# EAGLE design IotaWatt4.8 (EAGLE 8.1.1)
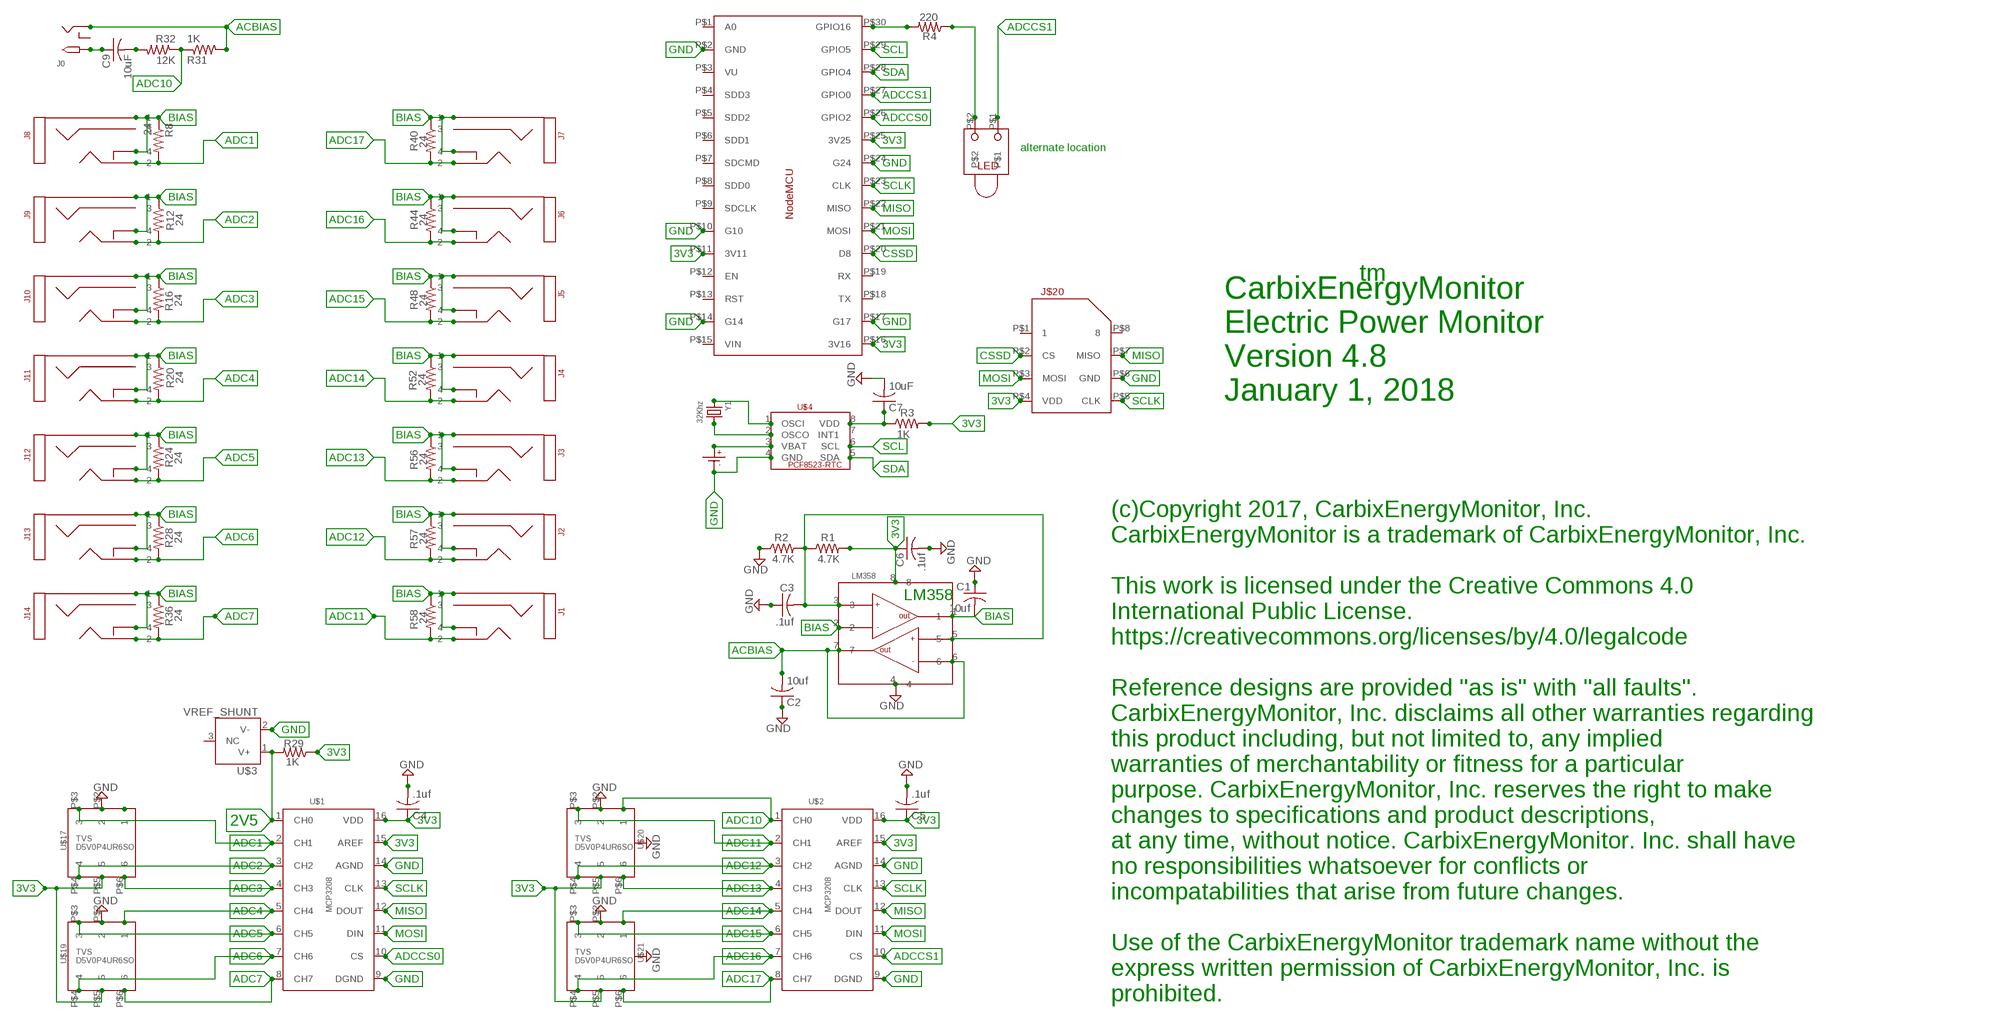
[diagram p0: schematic, sheet 1]

## Parts
C1  10uf  C-USC0805  [C0805]
C2  10uf  C-USC0805  [C0805]
C3  .1uf  C-USC0805  [C0805]
C4  .1uf  C-USC0805  [C0805]
C5  .1uf  C-USC0805  [C0805]
C6  .1uf  C-USC0805  [C0805]
C7  10uF  C-USC0805  [C0805]
C9  10uF  C-USC0805  [C0805]
J0  2.1MMJACKSMT  [DCJACK_2MM_SMT]
J1  STEREO_SMD  [STEREO_SMT]
J2  STEREO_SMD  [STEREO_SMT]
J3  STEREO_SMD  [STEREO_SMT]
J4  STEREO_SMD  [STEREO_SMT]
J5  STEREO_SMD  [STEREO_SMT]
J6  STEREO_SMD  [STEREO_SMT]
J7  STEREO_SMD  [STEREO_SMT]
J8  STEREO_SMD  [STEREO_SMT]
J9  STEREO_SMD  [STEREO_SMT]
J10  STEREO_SMD  [STEREO_SMT]
J11  STEREO_SMD  [STEREO_SMT]
J12  STEREO_SMD  [STEREO_SMT]
J13  STEREO_SMD  [STEREO_SMT]
J14  STEREO_SMD  [STEREO_SMT]
J$20  MICROSD_PUSH/PULL  [MICROSD]
R1  4.7K  R-US_R0805  [R0805]
R2  4.7K  R-US_R0805  [R0805]
R3  1K  R-US_R0805  [R0805]
R4  220  R-US_R0805  [R0805]
R8  24  R-US_R0805  [R0805]
R12  24  R-US_R0805  [R0805]
R16  24  R-US_R0805  [R0805]
R20  24  R-US_R0805  [R0805]
R24  24  R-US_R0805  [R0805]
R28  24  R-US_R0805  [R0805]
R29  1K  R-US_R0805  [R0805]
R31  1K  R-US_R0805  [R0805]
R32  12K  R-US_R0805  [R0805]
R36  24  R-US_R0805  [R0805]
R40  24  R-US_R0805  [R0805]
R44  24  R-US_R0805  [R0805]
R48  24  R-US_R0805  [R0805]
R52  24  R-US_R0805  [R0805]
R56  24  R-US_R0805  [R0805]
R57  24  R-US_R0805  [R0805]
R58  24  R-US_R0805  [R0805]
U$1  MCP3208  [SOIC_16]
U$2  MCP3208  [SOIC_16]
U$3  VREF_SHUNT  [SOT23_3]
U$4  PCF8523_RTC  [SOIC_8]
U$16  NODEMCU  [NODEMCU]
U$17  TVS_4CHAN_ARRAYSC-74  [SC-74]
U$18  CR1220SMD  [CR1220SMD]
U$19  TVS_4CHAN_ARRAYSC-74  [SC-74]
U$20  TVS_4CHAN_ARRAYSC-74  [SC-74]
U$21  TVS_4CHAN_ARRAYSC-74  [SC-74]
U$22  LM358_DUAL_OP-AMP  [SOIC_8]
U$23  LED_RT_TRH  [LED_TH_RT]
Y1  32Khz  CRYSTAL8X3.8SMT  [CRYSTAL_8X3.8]

## Nets
2V5: R29.2 U$1.1(CH0) U$3.1(V+)
3V3: C4.1 C5.1 C6.1 J$20.P$4(VDD) R1.2 R3.2 R29.1 U$1.15(AREF) U$1.16(VDD) U$2.15(AREF) U$2.16(VDD) U$16.P$11(3V11) U$16.P$16(3V16) U$16.P$25(3V25) U$17.P$5 U$19.P$5 U$20.P$5 U$21.P$5 U$22.8
ACBIAS: C2.2 J0.GND(RING) R31.2 U$22.6 U$22.7
ADC1: J8.P$2 R8.2 U$1.2(CH1) U$17.P$3
ADC2: J9.P$2 R12.2 U$1.3(CH2) U$17.P$4
ADC3: J10.P$2 R16.2 U$1.4(CH3) U$17.P$6
ADC4: J11.P$2 R20.2 U$1.5(CH4) U$19.P$1
ADC5: J12.P$2 R24.2 U$1.6(CH5) U$19.P$3
ADC6: J13.P$2 R28.2 U$1.7(CH6) U$19.P$4
ADC7: J14.P$2 R36.2 U$1.8(CH7) U$19.P$6
ADC10: R31.1 R32.1 U$2.1(CH0) U$20.P$1
ADC11: J1.P$2 R58.2 U$2.2(CH1) U$20.P$3
ADC12: J2.P$2 R57.2 U$2.3(CH2) U$20.P$4
ADC13: J3.P$2 R56.2 U$2.4(CH3) U$20.P$6
ADC14: J4.P$2 R52.2 U$2.5(CH4) U$21.P$1
ADC15: J5.P$2 R48.2 U$2.6(CH5) U$21.P$3
ADC16: J6.P$2 R44.2 U$2.7(CH6) U$21.P$4
ADC17: J7.P$2 R40.2 U$2.8(CH7) U$21.P$6
ADCCS0: U$1.10(CS) U$16.P$26(GPIO2)
ADCCS1: U$2.10(CS) U$16.P$27(GPIO0) U$23.P$1
BIAS: C1.2 J1.P$1 J1.P$4 J2.P$1 J2.P$4 J3.P$1 J3.P$4 J4.P$1 J4.P$4 J5.P$1 J5.P$4 J6.P$1 J6.P$4 J7.P$1 J7.P$4 J8.P$1 J8.P$4 J9.P$1 J9.P$4 J10.P$1 J10.P$4 J11.P$1 J11.P$4 J12.P$1 J12.P$4 J13.P$1 J13.P$4 J14.P$1 J14.P$4 R8.1 R12.1 R16.1 R20.1 R24.1 R28.1 R36.1 R40.1 R44.1 R48.1 R52.1 R56.1 R57.1 R58.1 U$22.1 U$22.2
CSSD: J$20.P$2(CS) U$16.P$20(D8)
GND: C1.1 C2.1 C3.1 C4.2 C5.2 C6.2 C7.2 J$20.P$6(GND) R2.1 U$1.9(DGND) U$1.14(AGND) U$2.9(DGND) U$2.14(AGND) U$3.2(V-) U$4.4(GND) U$16.P$2(GND) U$16.P$10(G10) U$16.P$14(G14) U$16.P$17(G17) U$16.P$24(G24) U$17.P$2 U$18.P-(P$-) U$19.P$2 U$20.P$2 U$21.P$2 U$22.4
MISO: J$20.P$7(MISO) U$1.12(DOUT) U$2.12(DOUT) U$16.P$22(MISO)
MOSI: J$20.P$3(MOSI) U$1.11(DIN) U$2.11(DIN) U$16.P$21(MOSI)
N$1: C7.1 R3.1 U$4.8(VDD)
N$8: R4.1 U$23.P$2
N$10: R4.2 U$16.P$30(GPIO16)
N$16: U$17.P$1
N$17: C9.2 R32.2
N$27: C9.1 J0.PWR2(TIP)
N$43: U$4.3(VBAT) U$18.P+(P$+)
N$44: U$4.2(OSCO) Y1.P$4
N$45: U$4.1(OSCI) Y1.P$1
SCL: U$4.6(SCL) U$16.P$29(GPIO5)
SCLK: J$20.P$5(CLK) U$1.13(CLK) U$2.13(CLK) U$16.P$23(CLK)
SDA: U$4.5(SDA) U$16.P$28(GPIO4)
VREF: C3.2 R1.1 R2.2 U$22.3 U$22.5
Unconnected: J0.GNDBREAK(RING_SW) J1.P$3 J2.P$3 J3.P$3 J4.P$3 J5.P$3 J6.P$3 J7.P$3 J8.P$3 J9.P$3 J10.P$3 J11.P$3 J12.P$3 J13.P$3 J14.P$3 J$20.P$1 J$20.P$8 U$3.3(NC) U$4.7(INT1) U$16.P$1(A0) U$16.P$3(VU) U$16.P$4(SDD3) U$16.P$5(SDD2) U$16.P$6(SDD1) U$16.P$7(SDCMD) U$16.P$8(SDD0) U$16.P$9(SDCLK) U$16.P$12(EN) U$16.P$13(RST) U$16.P$15(VIN) U$16.P$18(TX) U$16.P$19(RX)

## Notes on the sheet
- alternate location
- tm
- CarbixEnergyMonitor
  Electric Power Monitor
  Version 4.8
  January 1, 2018
- LM358
- (c)Copyright 2017, CarbixEnergyMonitor, Inc.
  CarbixEnergyMonitor is a trademark of CarbixEnergyMonitor, Inc.
  
  This work is licensed under the Creative Commons 4.0
  International Public License. 
  https://creativecommons.org/licenses/by/4.0/legalcode
  
  Reference designs are provided "as is" with "all faults". 
  CarbixEnergyMonitor, Inc. disclaims all other warranties regarding
  this product including, but not limited to, any implied 
  warranties of merchantability or fitness for a particular 
  purpose. CarbixEnergyMonitor, Inc. reserves the right to make
  changes to specifications and product descriptions, 
  at any time, without notice. CarbixEnergyMonitor. Inc. shall have
  no responsibilities whatsoever for conflicts or 
  incompatabilities that arise from future changes.
  
  Use of the CarbixEnergyMonitor trademark name without the
  express written permission of CarbixEnergyMonitor, Inc. is
  prohibited.

## Library data of the parts
C1-C7 C9 = adafruit:C-US: CAPACITOR, American symbol
J0 = CarbixEnergyMonitor_parts:2.1MMJACK: 2.1mm x 5.5mm THM DC jack with internal switch. Digikey part #PJ-102A, 4UCON part #05537 2.1mm x 5.5mm SMT DC jack with internal switch. Digikey part #PJ-002A-SMT, 4UCON part #03267 By microbuilder.eu & adafruit.com
J1-J14 = CarbixEnergyMonitor_parts:STEREO_SMD: 3.5mm Stereo Jack SMT
J$20 = CarbixEnergyMonitor_parts:MICROSD_PUSH/PULL: McroSD Amphenol push/pull
R1-R4 R8 R12 R16 R20 R24 R28 R29 R31 R32 R36 R40 R44 R48 R52 R56-R58 = adafruit:R-US_: RESISTOR, American symbol
U$1 U$2 = CarbixEnergyMonitor_parts:MCP3208: MCP3208 12bit SPI ADC
U$3 = CarbixEnergyMonitor_parts:VREF_SHUNT: Voltage Reference Shunt - SOT23-3 (ADR504, etc.)
U$4 = CarbixEnergyMonitor_parts:PCF8523_RTC: PCF8523-RTC SOIC-8
U$16 = CarbixEnergyMonitor_parts:NODEMCU: NodeMCU 1.0 ESP8266
U$17 U$19-U$21 = CarbixEnergyMonitor_parts:TVS_4CHAN_ARRAY: TVS 4 channel array
U$18 = CarbixEnergyMonitor_parts:CR1220SMD: CR1220 Battery SMD
U$22 = CarbixEnergyMonitor_parts:LM358_DUAL_OP-AMP: LM358 Dual Op-Amp - SOIC8
U$23 = CarbixEnergyMonitor_parts:LED_RT_TRH: LED RT ThruHole BiColor Digikey 67-2237-ND
Y1 = microbuilder:CRYSTAL: Crystals HC49UP - Surface Mount Crystal 4.0MHz 18pF +/-30ppm Surface Mount Crystal [Digikey: 535-9857-1-ND] 12.0 MHz Surface Mount Crystal [Digikey: 535-9869-6-ND] 25.0 MHz Surface Mount Crystal [Digikey: 535-9078-1-ND] 2.5 x 2.0mm - MEMs SMT Crystal 16.0 MHz 10pF 20ppm 2.5 x 2.0mm Crystal [Digikey -40-85°C: 535-10923-1-ND] 3.2 x 2.5mm - MEMs SMT Crystal 12.0 MHz 8pF 15ppm 3.2 x 2.5mm Crystal [Digikey: -10-70°C: 644-1047-1-ND -40-125°C: 644-1128-1-ND] 16.0 MHz 8pF 15ppm 3.2 x 2.5mm Crystal [Digikey: -10-70°C: 644-1049-1-ND -40-125°C: 644-1129-2-ND] 16.0 MHz 10pF 10ppm 3.2 x 2.5mm Crystal [Digikey: 644-1100-1-ND] 27.12 MHz 18pF 30ppm 3.2 x 2.5mm Crystal [Digikey: 887-1424-1-ND] 27.12MHz 10pF 10ppm 3.2 x 2.5mm Crystal [Digikey: 887-1329-1-ND] 4.9 x 1.8mm - MEMs SMT Crystal 32.768 KHz 12.5pF 20ppm 4.9 x 1.8mm Crystal [Digikey: SE2415CT-ND] 8.0 x 3.8mm - Surface Mount Crystal 32.768kHz 12.5pF 20ppm -40°C-85°C [Digikey: 535-9166-2-ND] Cylinder 32.768KHz Cylinder Crystal (2x6mm body) [Ex. Digikey: 300-8341-2-ND]

## Board
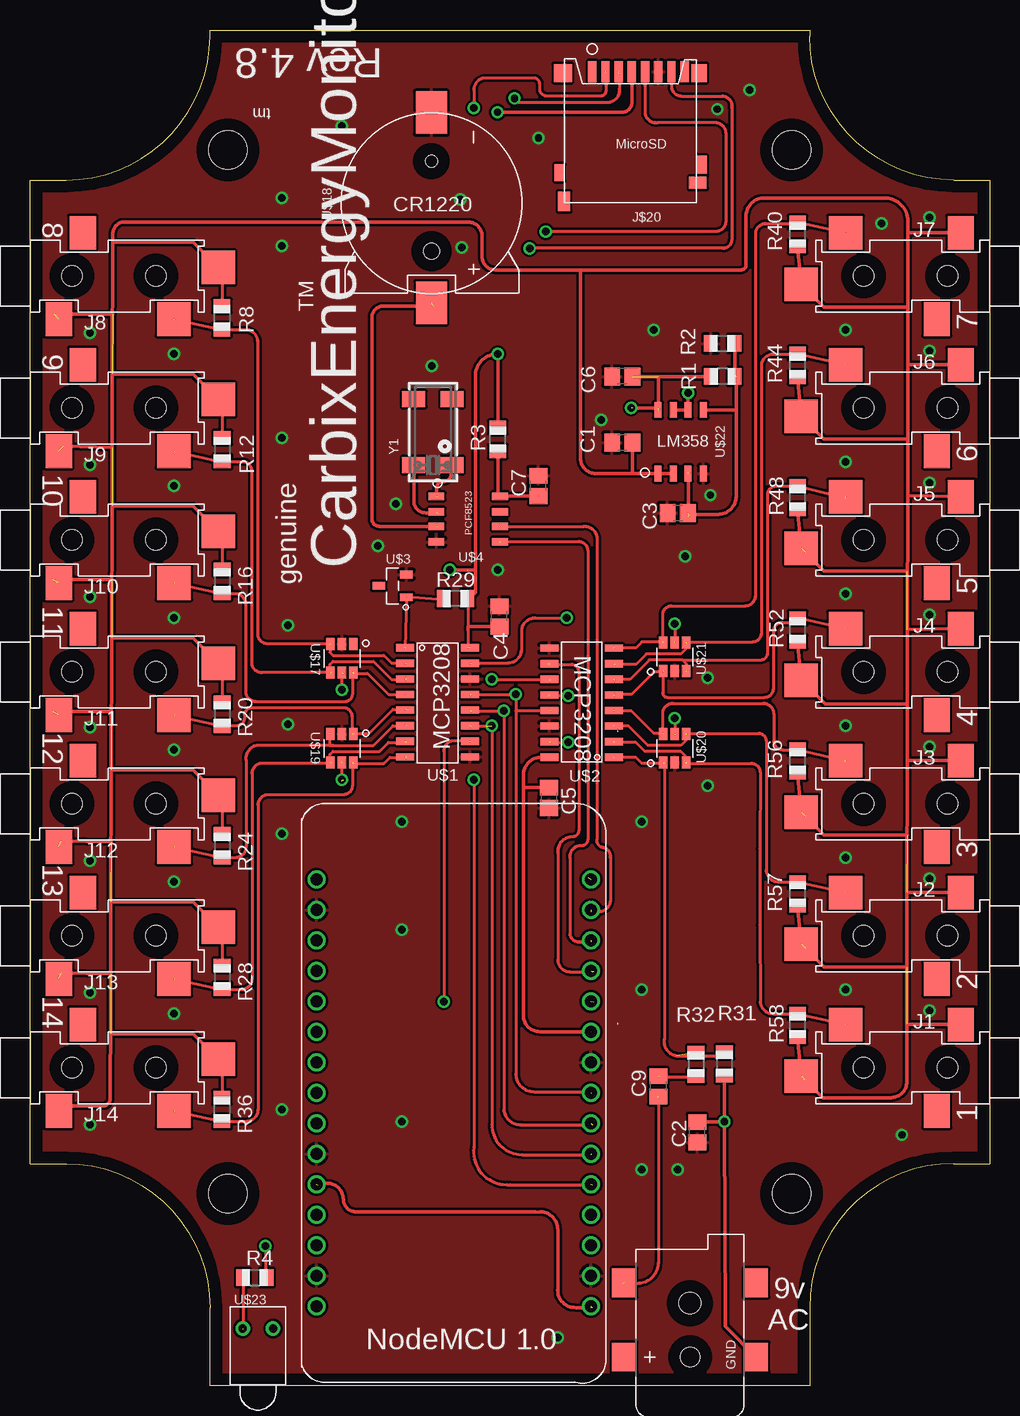
[diagram p1: board, top side]
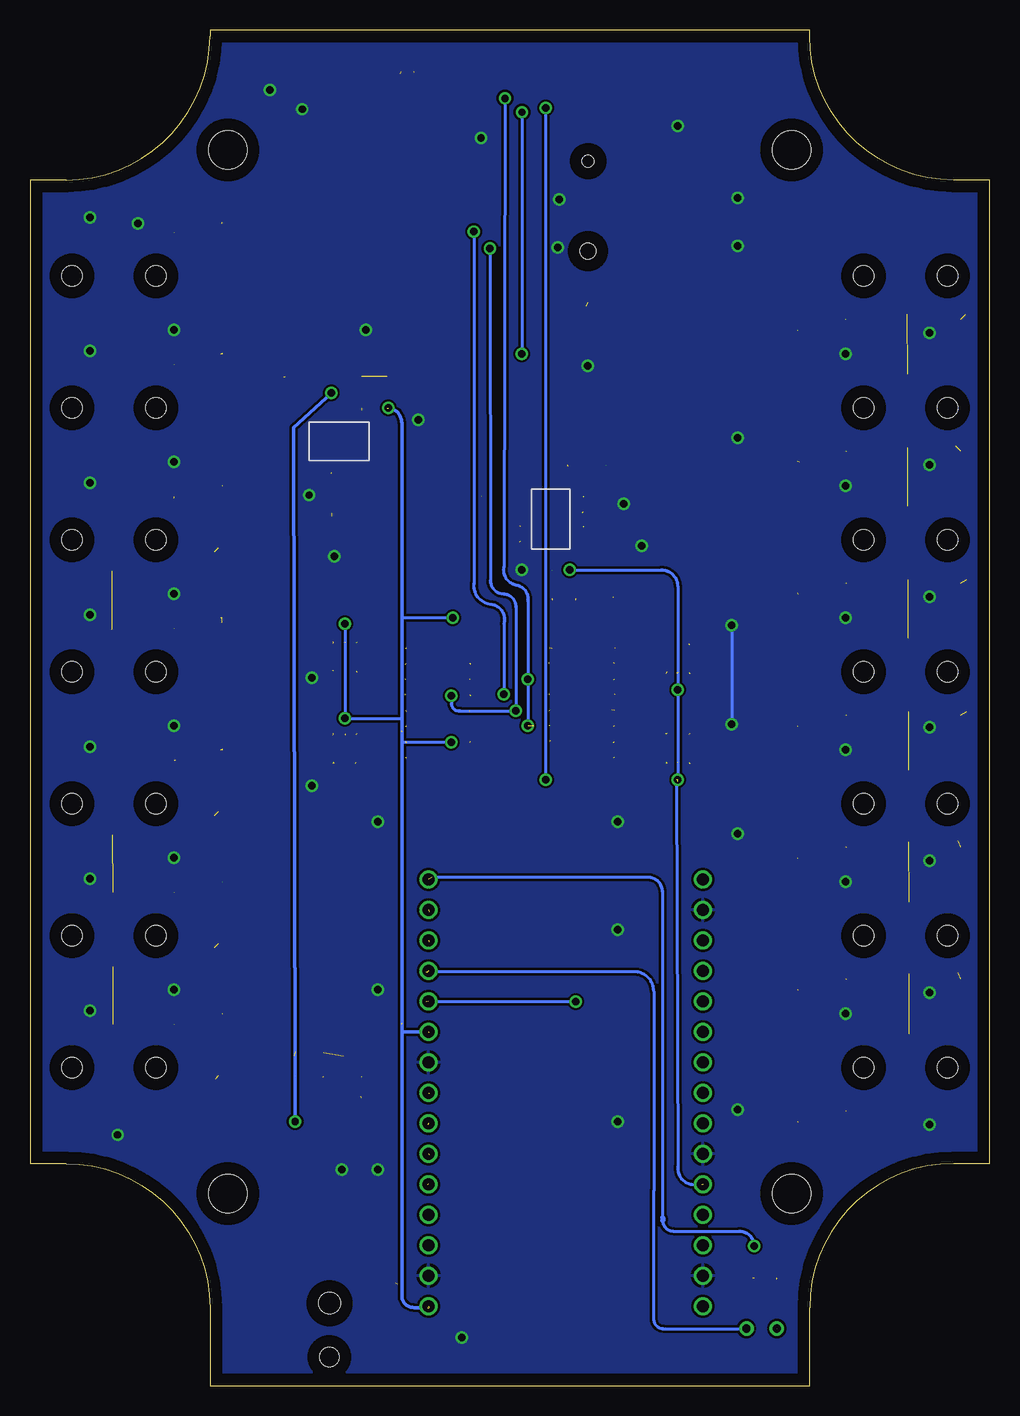
[diagram p2: board, bottom side, seen from below]

Size 80 x 113 mm. Coordinates in mm from the lower left corner, seen from the top.
Outline: 0,18.5 0,100.5 3,100.5 arc90 15,112.5 15,113 65,113 65,112.5 arc90 77,100.5 80,100.5 80,18.5 77,18.5 arc90 65,6.5 65,0 15,0 15,6.5 arc90 3,18.5 0,18.5
Copper layers (1*16): Top 0.035mm / dielectric 1.5mm / Bottom 0.035mm
Design rules "default *": minimum track width 10mil, minimum drill 10mil, track to track 8mil, track to pad 8mil, pad to pad 8mil, via to via 8mil, smd to smd 8mil, copper to edge 40mil, drill to drill 8mil, minimum pad ring 10mil, minimum via ring 8mil, stop-mask expansion 4mil, vias tented up to drill 0mil, thermal gap 10mil
Holes 3.2 mm at 16.5,16 63.5,16 63.5,103 16.5,103

### Footprints (pad centres in the part's own frame; a part is rotated, then mirrored left to right if it is on the bottom)
C0805 = smd 1.3 x 1.5: 1 -0.85,0; 2 0.85,0
DCJACK_2MM_SMT = smd 2.4 x 2: GND 0,-5.5; GNDBREAK 6.2,-5.5; PWR1 0,5.5; PWR2 6.2,5.5 | hole 1.6: 0,0 | hole 1.8: 4.5,0
STEREO_SMT = smd 2.8 x 2.2: P$1 -3.6,-2.4; P$3 3.6,-4.4 | smd 2.8 x 2.8: P$2 -3.6,-12; P$4 0.7,-15.7 | hole 1.7: 0,-3.5; 0,-10.5
MICROSD = smd 0.7 x 1.75: P$1 3.2,-0.9; P$2 2.1,-0.9; P$3 1,-0.9; P$4 -0.1,-0.9; P$5 -1.2,-0.9; P$6 -2.3,-0.9; P$7 -3.4,-0.9; P$8 -4.5,-0.9 | smd 1.3 x 1.5: P$9 -5.7,-0.8 | smd 1.5 x 1.5: P$10 5.65,-0.8 | smd 0.8 x 1.5: P$11 -5.95,6.85 | smd 0.8 x 1.4: P$13 5.95,7.5 | smd 1 x 1.65: P$CD1 5.55,9.9 | smd 1.45 x 1: P$CD2 -5.6,8.35
R0805 = smd 1.1 x 1.4: 1 -1,0; 2 1,0
SOIC_16 = smd 1.5 x 0.6: 1 -2.7,5.2; 2 -2.7,3.9; 3 -2.7,2.6; 4 -2.7,1.3; 5 -2.7,0; 6 -2.7,-1.3; 7 -2.7,-2.6; 8 -2.7,-3.9; 9 2.7,-3.9; 10 2.7,-2.6; 11 2.7,-1.3; 12 2.7,0; 13 2.7,1.3; 14 2.7,2.6; 15 2.7,3.9; 16 2.7,5.2
SOT23_3 = smd 1.05 x 0.65: 1 -1.15,0.95; 2 -1.15,-0.95; 3 1.15,0
SOIC_8 = smd 1.3 x 0.6: 1 -2.6,1.9; 2 -2.6,0.6; 3 -2.6,-0.6; 4 -2.6,-1.9; 5 2.7,-1.9; 6 2.7,-0.6; 7 2.7,0.6; 8 2.7,1.9
NODEMCU = drill 1: P$1 -11.43,17.78; P$2 -11.43,15.24; P$3 -11.43,12.7; P$4 -11.43,10.16; P$5 -11.43,7.62; P$6 -11.43,5.08; P$7 -11.43,2.54; P$8 -11.43,0; P$9 -11.43,-2.54; P$10 -11.43,-5.08; P$11 -11.43,-7.62; P$12 -11.43,-10.16; P$13 -11.43,-12.7; P$14 -11.43,-15.24; P$15 -11.43,-17.78; P$16 11.43,-17.78; P$17 11.43,-15.24; P$18 11.43,-12.7; P$19 11.43,-10.16; P$20 11.43,-7.62; P$21 11.43,-5.08; P$22 11.43,-2.54; P$23 11.43,0; P$24 11.43,2.54; P$25 11.43,5.08; P$26 11.43,7.62; P$27 11.43,10.16; P$28 11.43,12.7; P$29 11.43,15.24; P$30 11.43,17.78
SC-74 = smd 1 x 0.7: P$1 -1.2,0.95; P$2 -1.2,0; P$3 -1.2,-0.95; P$4 1.2,-0.95; P$5 1.2,0; P$6 1.2,0.95
CR1220SMD = smd 3.54 x 2.6: P+ 8.3,0; P- -7.55,0 | hole 1: -3.5,0 | hole 1.3: 4,0
LED_TH_RT = drill 0.7: P$1 1.27,0; P$2 -1.27,0
CRYSTAL_8X3.8 = smd 1.3 x 1.9: P$1 -2.75,-1.6; P$2 2.75,-1.6; P$3 2.75,1.6; P$4 -2.75,1.6

### Placement (x,y rotation side)
C1  49.38,78.62 0 top
C2  55.62,21.12 90 top
C3  54,72.75 0 top
C4  39.12,64.12 90 top
C5  43.25,49 270 top
C6  49.38,84.12 180 top
C7  42.38,75 90 top
C9  52.4,24.94 90 top
J0  55.03,2.37 90 top
J1  80,26.5 270 top
J2  80,37.5 270 top
J3  80,48.5 270 top
J4  80,59.5 270 top
J5  80,70.5 270 top
J6  80,81.5 270 top
J7  80,92.5 270 top
J8  0,92.5 90 top
J9  0,81.5 90 top
J10  0,70.5 90 top
J11  0,59.5 90 top
J12  0,48.5 90 top
J13  0,37.5 90 top
J14  0,26.5 90 top
J$20  50.08,108.61 180 top
R1  57.75,84.12 180 top
R2  57.75,86.88 0 top
R3  39,78.88 90 top
R4  18.75,9 0 top
R8  16,89 270 top
R12  16.03,78.02 270 top
R16  16.03,67.05 270 top
R20  16.03,55.96 270 top
R24  16.03,44.99 270 top
R28  16.03,34.03 270 top
R29  35.48,65.59 180 top
R31  57.91,26.82 270 top
R32  55.53,26.77 270 top
R36  16,23.01 270 top
R40  63.99,95.95 90 top
R44  63.99,85.05 90 top
R48  63.99,74.01 90 top
R52  63.99,62.98 90 top
R56  63.99,52.06 90 top
R57  63.99,40.98 90 top
R58  63.99,30.03 90 top
U$1  33.99,56.3 0 top
U$2  46.01,57.57 180 top
U$3  30.23,66.67 180 top
U$4  36.49,72.23 0 top
U$16  35.33,24.4 0 top
U$17  26,60.62 270 top
U$18  33.47,98.56 270 top
U$19  26,53.12 270 top
U$20  53.75,53.12 90 top
U$21  53.75,60.75 90 top
U$22  54.25,78.62 90 top
U$23  19,4.75 0 top
Y1  33.59,79.48 90 top

### Tracks (layer width: path | path; a pad name or v marks a point on that pad's centre or on a via)
2V5  (3 unrouted)
  Top 0.254: 34.5,65.5 31.38,65.75 31.25,61.5
3V3  (via drill 0.6)  (21 unrouted)
  Top 0.254: 24.75,16.88 24.12,16.88 arc90 24,16.75 | v26,58 26,59.25 arc-90 26.12,59.38 | v53.75,63.5 53.75,62 | v53.75,55.62 53.75,54.25 | 43.38,53.75 43.38,53.62 v44.88,53.62 | 36.5,65.5 36.5,63 36.5,61.5 | v26,50.5 26,52 | 36.75,60.25 39.88,60.25 arc90 41,61.38 41,62.88 arc-90 42.12,64 v44.75,64 44.88,64 | 42.12,14.5 42.5,14.5 | 44,8 arc90 44,7.88
  Top 0.305: 42.12,14.5 27.38,14.5 arc-90 26.12,15.38 26.12,15.5 arc90 24.75,16.88 | 52.38,81.47 52.38,81.5 | 52.38,84.12 52.38,81.5 | v50.12,81.5 52.38,81.5 | 42.5,14.5 arc-90 44,13 44,8 | 44,7.88 arc90 45.5,6.5 46.88,6.5 | 36.5,68 v35,68 | C4.1 36.5,63.27 36.5,63 | U$2.16 42.62,52.37 arc90 41.12,50.88 41.12,50 | U$16.P$25 arc90 46.74,29.5 42.5,29.5 arc-90 41.12,30.88 41.12,50 | C5.1 41.27,49.85 arc-90 41.12,50 | R1.2 C6.1 | 37.12,68 37.12,66.12 36.5,65.5 | 37.12,68 37.12,84.12 arc-90 v39,86 R3.2 | 36.48,68 37.12,68 | J$20.P$4 50.18,107.08 arc-90 49.45,106.14 v38.99,106.14 arc90 v38.98,106.14
  Bottom 0.254: 26.12,50.5 26,18.12 | 26,18.25 26,18.12 | 26,18.12 arc-90 24.62,16.75 23.88,16.75 | v26,58 26,50.38 | v53.75,63.5 v53.75,55.62 49,55.62 | v35,68 27.38,68 arc90 26,66.62 v26,58 | v26,58 arc-90 25.88,57.88 | v38.98,106.14 v39,86 | v44.75,64 49,64 | v44.88,53.62 49,53.62
  Bottom 0.305: 49,54.5 49,53.62 49,30.25 | 49,54.62 49,55.62 49,64 49,80.25 arc-90 50.25,81.5 | 49,30.12 49,29.5 | 49,29.5 49,7.5 arc-90 48,6.5 46.75,6.5 | 46.75,29.5 49,29.5
ACBIAS  (via drill 0.6)  (1 unrouted)
  Top 0.305: v57.91,22 R31.2 | v57.91,22 57.91,21.4 57.98,5.42 57.98,4.92 J0.GND | C2.2 v57.91,22 | U$22.7 U$22.6 54.85,82.62 v54.88,82.75
  Bottom 0.305: v54.88,82.75 58.02,79.85 57.9,25.8 v57.9,22
ADC1  (4 unrouted)
  Top 0.254: R8.2 12,88.88 | 25,61.75 25,61.12 25.25,60.88 29.5,60.88 30.12,60.25 31.38,60.25 | U$17.P$3 19.8,61.83 arc-90 19,62.62 19,87 arc90 18,88 R8.2 arc90 R8.2
ADC2  (4 unrouted)
  Top 0.254: 15.88,77 12,77.88 | 25,59.38 25,60.12 25.25,60.38 28.62,60.38 30.12,58.88 31.38,58.88 | U$17.P$4 19.32,59.42 arc-90 18.5,60.25 18.5,76.25 arc90 17.75,77 16.05,77 arc-90 R12.2
ADC3  (5 unrouted)
  Top 0.254: 26.88,59.5 26.88,57.62 arc-90 26.25,57 18.88,57 arc-90 18,57.88 18,65.12 arc90 17.12,66 16,66 12,66.88 | 27,59.38 28.12,59.38 29.88,57.62 31.25,57.62
ADC4  (5 unrouted)
  Top 0.254: 27,54.38 28.25,54.38 30.25,56.38 31.5,56.38 | 26.88,54.38 26.88,55.75 arc90 26.12,56.5 18.5,56.5 arc90 17.88,55.88 17.88,55.62 arc-90 17.25,55 16,55 12,55.88
ADC5  (4 unrouted)
  Top 0.254: 12,44.88 16,44 17.12,44 arc90 18,44.88 18,52.12 arc-90 19,53.38 25,53.38 25,54.38 | 25.25,53.38 28.62,53.38 30.25,55 31.38,55
  Top 0.305: 25.25,53.38 25,53.38
ADC6  (4 unrouted)
  Top 0.254: 12,33.88 16,33 17.62,33 arc90 18.5,33.88 18.5,51 arc-90 19.38,51.88 25,51.88 25,52.62 25.25,52.88 29.12,52.88 29.88,53.62 31.38,53.62
ADC7  (5 unrouted)
  Top 0.254: 12,22.88 R36.2 18,22 arc90 19,23 19,48.38 arc-90 19.88,49.25 26.12,49.25 arc90 26.88,50 26.88,51.88 | 27,51.88 29.5,51.88 30,52.38 31.38,52.38
ADC10  (4 unrouted)
  Top 0.254: 48.62,52.38 50.5,52.38 51,51.88 52.88,51.88 52.88,28.88 arc90 53.88,27.5 58,27.5
ADC11  (5 unrouted)
  Top 0.254: 54.75,51.88 60.12,51.88 arc-90 60.88,51.12 arc1 60.88,32 arc89 62,31 arc1 64,31 68,30.12 | 54.62,51.88 54.62,52.5 54.25,52.88 51.25,52.88 50.5,53.62 48.62,53.62
ADC12  (5 unrouted)
  Top 0.254: 54.75,54.38 60.75,54.38 arc-90 61.38,53.75 61.38,43 arc90 62.38,42 64,42 68,41.12 | 54.75,54.25 54.75,53.88 54.25,53.38 51.5,53.38 49.88,55 48.62,55
ADC13  (5 unrouted)
  Top 0.254: 64.12,53 67.88,52.12 | 48.62,56.25 50.12,56.25 52,54.38 52.75,54.38 52.75,56 arc-90 53.62,56.88 61.12,56.88 arc-90 62,56 62,53.75 arc90 62.75,53 64,53 arc90 64.12,53.12
ADC14  (5 unrouted)
  Top 0.254: 64.12,64 68,63.12 | 48.75,57.62 50.12,57.62 52,59.5 52.75,59.5 52.75,57.75 arc90 53.12,57.38 61.25,57.38 arc90 62,58.12 62,62.88 arc-90 62.75,63.62 64,63.62
ADC15  (4 unrouted)
  Top 0.254: 54.38,60.5 61,60.5 arc90 61.5,61.12 61.5,74.25 arc-90 62.25,75 R48.2 68,74 | 54.75,59.62 54.75,60.12 54.38,60.5 | 54.38,60.5 54.25,60.5 51.62,60.5 50,58.88 48.75,58.88
ADC16  (6 unrouted)
  Top 0.254: 64.12,86 68,85.12 | 54.75,61.88 54.75,61.5 54.25,61 51.38,61 50.5,60.12 48.75,60.12 | 54.75,62 60.25,62 arc90 61,62.75 61,85 arc-90 62,86 64,86
ADC17  (5 unrouted)
  Top 0.254: 48.62,61.5 50.5,61.5 51,62 52.75,62 52.75,64.25 arc-90 53.5,65 59.62,65 arc90 60.5,65.88 60.5,96 arc-90 61.38,96.88 64,96.88 | 64,97 68,96.12
ADCCS0  (via drill 0.6)  (2 unrouted)
  Top 0.254: 36.62,53.75 35.38,53.75 arc90 34.5,52.88 v34.5,32
  Bottom 0.254: v34.5,32 47,32
ADCCS1  (3 unrouted)
  Top 0.254: 43.25,60.12 45.12,60.12 arc-90 45.75,59.5 45.75,46.25 arc-90 45.25,45.75 arc95 44,44.38 44,35.5 arc90 45,34.5 46.88,34.5
  Bottom 0.254: 47,34.5 29.62,34.5 arc90 28,32.88 28,16.25 arc-90 28,16.25 28,5.54 arc-90 27.2,4.74 U$23.P$1 arc-90 U$23.P$1
BIAS  (19 unrouted)
  Top 0.254: J14.P$4 16,27.2 R36.1 | J13.P$4 16.03,38.2 R28.1 | J12.P$4 16.03,49.2 R24.1 | J11.P$4 16.03,60.2 R20.1 | J10.P$4 16.03,71.2 R16.1 | J9.P$4 16.03,82.2 R12.1 | J8.P$4 16,93.2 R8.1
  Top 0.305: U$22.2 U$22.1 50.2,76.03 | 50.2,76.03 47.17,76.03 arc-90 45.9,77.3 45.9,93 | C1.2 50.23,76.05 arc-90 50.2,76.03 | 45.9,93 arc90 46,93 | 45.9,93 38.8,93 arc-90 37.7,94.1 37.7,95.8 arc90 36.5,97 7.9,97 arc90 6.9,96 6.9,95.3 | 6.9,95.3 6.87,84.3 | 6.87,84.3 6.83,73.3 | 6.83,73.3 6.8,62.3 | 6.8,62.3 6.77,51.3 | 6.77,51.3 6.74,40.3 | 6.74,40.3 6.71,29.3 | 6.71,29.3 6.7,25.93 6.7,24.02 arc-90 6.1,23.3 2.8,23.3 arc90 J14.P$1 | 6.9,95.3 13.6,95.3 J8.P$4 | 6.87,84.3 13.6,84.3 J9.P$4 | 6.83,73.3 13.6,73.3 J10.P$4 | 6.8,62.3 13.6,62.3 J11.P$4 | 6.77,51.3 13.6,51.3 J12.P$4 | 6.74,40.3 13.6,40.3 J13.P$4 | 6.71,29.3 13.6,29.3 J14.P$4 | 6.72,34.3 2.6,34.4 | 6.76,45.3 2.6,45.4 | 6.79,56.2 1.9,56.2 | 6.82,67.2 1.9,67.2 | 6.85,78.2 2.8,78.3 | 6.88,89.3 2,89.3 | J7.P$1 73.2,96.1 | 73.14,52.12 73.12,41.12 | 73.15,63.03 73.14,56.8 | 73.14,56.8 73.14,52.12 | 73.17,74.18 73.15,63.03 | 73.18,85.12 73.18,78.9 | 73.18,78.9 73.17,74.18 | 73.18,85.12 73.19,89.9 | 73.19,89.9 73.2,96.1 | 73.12,41.12 73.12,40.9 73.11,30.09 | 73.11,30.09 73.1,25.6 73.1,25.3 arc-90 71.8,24 66.1,24 64.58,25.52 | J1.P$1 73.11,30.09 | J2.P$1 73.12,41.12 | J3.P$1 73.14,52.12 | J4.P$1 73.15,63.03 | J5.P$1 73.17,74.18 | J6.P$1 73.18,85.12 | 73.11,34.9 66.2,34.9 64.64,36.46 | 73.13,45.9 66.2,45.9 64.64,47.46 | 73.14,56.8 66.3,56.8 J4.P$4 R52.1 | 73.16,67.9 66.2,67.9 64.64,69.46 | 73.18,78.9 66.2,78.9 J6.P$4 R44.1 | 73.19,89.9 66.2,89.9 J7.P$4 R40.1 | R48.1 J5.P$4 | R56.1 J3.P$4 | R57.1 J2.P$4 | R58.1 J1.P$4 | 73.2,96.1 73.2,97.1 arc90 71.2,99 arc-90 71.1,99 61.2,99 arc90 59.7,97.5 59.7,93.4 arc-90 59.3,93 45.9,93
CSSD  (via drill 0.6)  (2 unrouted)
  Top 0.254: 48,109.5 48,107.88 arc-90 47.62,107.5 43.02,107.5 arc-90 42.5,108.12 42.5,108.5 arc90 42,109 38,109 arc90 37,108 v37,106.5 | v37,50.5 37,19.88 arc103 40,16.75 46.88,16.75
  Bottom 0.254: v37,50.5 37,106.29 arc-45 v37,106.5
GND  (via drill 0.6)
  Bottom 0.254: v21.5,63.38 v21.5,55.12 arc-90 21.38,55
  other vias: 60,108 75,86.25 75,75.25 75,64.25 75,53.25 75,42.25 75,31.25 72.7,20.9 26,105 5,87.75 5,76.75 5,65.75 5,54.88 5,43.75 5,32.75 5,21.75 31,47 39,68 33.5,85 30.5,73.5 29,70 56.5,59 56.5,50 21,95 54.62,69.12 51,47 31,38 31,22 21,99 36,94.88 35.88,98.88 75,97.38 71,96.88 68,88 68,77 68,66 68,55 68,44 68,33 12,31 12,42 12,53 12,64 12,75 12,86 21,79 52,88 47.62,80.5 51,33 51,18 54,18 44,4 21,23 21,46 57.3,106.4 56.73,74.22 42.4,104
  pour Top: 0,0 0,113 80,113 80,0
  pour Bottom: 0,0 0,113 80,113 80,0
MISO  (via drill 0.6)  (3 unrouted)
  Top 0.254: 36.75,56.25 v39.5,56.25 39.5,23 arc90 41,21.75 46.88,21.75 | v44.88,57.5 43.25,57.5 | J$20.P$7 53.48,108.32 arc90 54.3,107.5 57.7,107.5 arc-103 58.5,106.5 58.5,95.5 arc-90 57.8,94.8 v41.67,94.8 arc90 v41.66,94.79
  Bottom 0.254: v41.66,94.79 41.62,67.12 arc-90 40.5,66 arc90 39.5,64.88 v39.5,56.25 | v44.88,57.5 44.88,56.88 arc-100 44.12,56.25 v39.5,56.25 | v39.5,56.25 arc-90 39.38,56.12
MOSI  (via drill 0.6)  (5 unrouted)
  Top 0.254: v38.5,58.88 43.38,58.88 | v38.5,55 38.5,21.75 arc90 41,19.25 46.75,19.25 | 49.12,109.38 49.12,108.12 arc-90 48.25,106.95 40.75,106.95 arc-90 v40.4,107.3 | 36.75,55 38,55
  Bottom 0.254: v40.4,107.3 40.5,68.25 arc-90 39.5,66.75 arc90 38.5,65.38 v38.5,58.88 v38.5,55
N$1  (1 unrouted)
  Top 0.305: 42.38,74.13 U$4.8 arc-90 39,74.32 R3.1
N$8  (2 unrouted)
  Top 0.254: 17.75,8.88 17.75,4.75
N$10  (via drill 0.6)  (2 unrouted)
  Top 0.254: v19.62,11.62 19.62,9
  Bottom 0.254: 27.25,14 27.25,41.12 arc-90 28.5,42.38 46.5,42.38 | 27.25,13.75 arc-90 26.38,12.88 20.88,12.88 arc90 v19.62,11.62
  Bottom 0.406: 27.25,14 27.25,13.75
N$17  (2 unrouted)
  Top 0.254: 52.38,25.75 55.62,25.75
N$27  (2 unrouted)
  Top 0.254: 52.38,24 52.38,10.25 arc-90 50.62,8.5 49.38,8.5
N$43  (2 unrouted)
  Top 0.305: 33.88,71.62 29.12,71.62 arc-90 28.5,72.25 28.5,89 arc-90 29.5,90 33.62,90
N$44  (2 unrouted)
  Top 0.305: 32,76.75 32,73.75 arc90 33,72.75 34,72.75
N$45  (2 unrouted)
  Top 0.305: 35.12,76.62 35.12,76 arc-90 34.5,75.38 arc90 33.88,74.75 33.88,74.12
SCL  (2 unrouted)
  Top 0.254: 39.12,71.62 46.12,71.62 arc-90 47.25,70.75 47.25,45.5 arc90 47.75,44.88 arc-90 48.38,44 48.38,40.38 arc-90 47.38,39.5 46.75,39.5
SCLK  (via drill 0.6)  (3 unrouted)
  Top 0.254: 36.75,57.62 v40.5,57.62 40.5,56.25 | 40.5,56.25 40.5,26 arc90 42,24.5 46.62,24.5 arc-90 46.75,24.38 | 43.38,56.25 40.5,56.25 | J$20.P$5 51.28,106.02 arc90 52.4,105.3 57.1,105.3 arc-90 58,104.4 58,97 arc-90 57.2,96.2 v43,96.2
  Bottom 0.254: v43,96.2 43,66.88 arc-94 41.5,65.12 arc97 40.5,63.5 v40.5,57.62
SDA  (2 unrouted)
  Top 0.254: 39.12,70.38 45.75,70.38 arc-82 46.5,69.62 46.5,45.5 arc-90 46,45 arc98 45,44 45,37.62 arc90 45.88,37 46.75,37
VREF  (3 unrouted)
  Top 0.305: 58.88,81 58.88,84.12 | 58.88,81 58.88,74.12 arc-90 57.38,72.62 54.5,72.62 arc-90 54.88,72.5 54.88,76.12 | U$22.5 58.88,81.33 58.88,81 | R2.2 R1.1

### Text on the board
_tsilk: Rev 4.8 | tm | 8 | TM | 7 | 9 | LM358 | 6 | 10 | PCF8523 | CarbixEnergyMonitor | genuine | 5 | 11 | MCP3208 | (c)Copyright 2017, CarbixEnergyMonitor, Inc. / CarbixEnergyMonitor is a trademark of CarbixEnergyMonitor, Inc. / / This work is licensed under the Creative Commons 4.0 / International Public License. / https://creativecommons.org/licenses/by/4.0/legalcode / / Reference designs are provided "as is" with "all faults". / CarbixEnergyMonitor, Inc. disclaims all other warranties regarding / this product including, but not limited to, any implied / warranties of merchantability or fitness for a particular / purpose. CarbixEnergyMonitor, Inc. reserves the right to make / changes to specifications and product descriptions, / at any time, without notice. CarbixEnergyMonitor. Inc. shall have / no responsibilities whatsoever for conflicts or / incompatabilities that arise from future changes. / / Use of the CarbixEnergyMonitor trademark name without the / express written permission of CarbixEnergyMonitor, Inc. is / prohibited. | 4 | 12 | MCP3208 | 13 | 3 | 2 | 14 | 1 | 9v | AC | NodeMCU 1.0